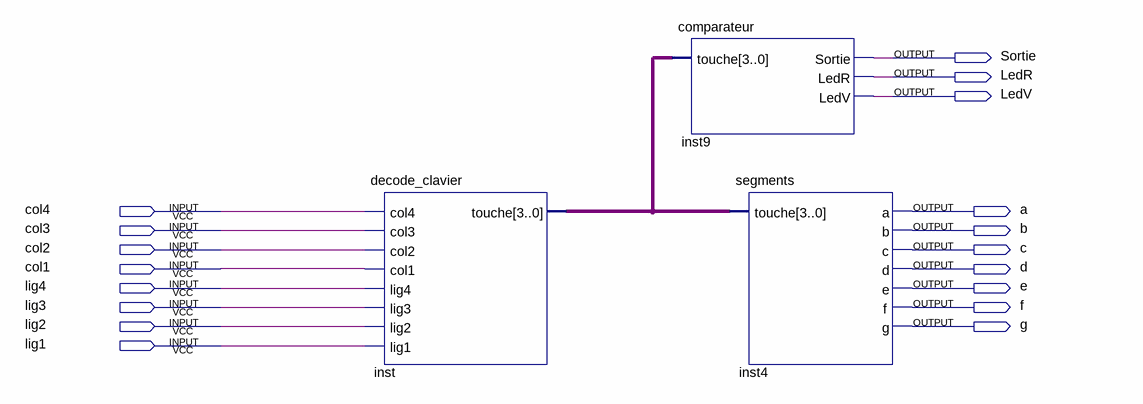
[diagram p0: schematic sheet]
// Quartus schematic serrure.bdf as structural Verilog: 3 symbols, 18 pins
module serrure (
  input  col4,
  input  col3,
  input  col2,
  input  col1,
  input  lig4,
  input  lig3,
  input  lig2,
  input  lig1,
  output Sortie,
  output LedR,
  output LedV,
  output a,
  output b,
  output c,
  output d,
  output e,
  output f,
  output g
);

  wire [3:0] inst_touche;

  decode_clavier inst (
    .col4(col4), .col3(col3), .col2(col2), .col1(col1), .lig4(lig4), .lig3(lig3), .lig2(lig2), .lig1(lig1),
    .touche(inst_touche));
  comparateur inst9 (.touche(inst_touche), .Sortie(Sortie), .LedR(LedR), .LedV(LedV));
  segments inst4 (.touche(inst_touche), .a(a), .b(b), .c(c), .d(d), .e(e), .f(f), .g(g));
endmodule
